# Altium schematic sheet RoBeast_Power_Switching.SchDoc: Power (Switching Regulator)
size A4; ApprovedBy: CR; DrawnBy: VM & IG; Revision: V1; SheetNumber: 3; SheetTotal: 9
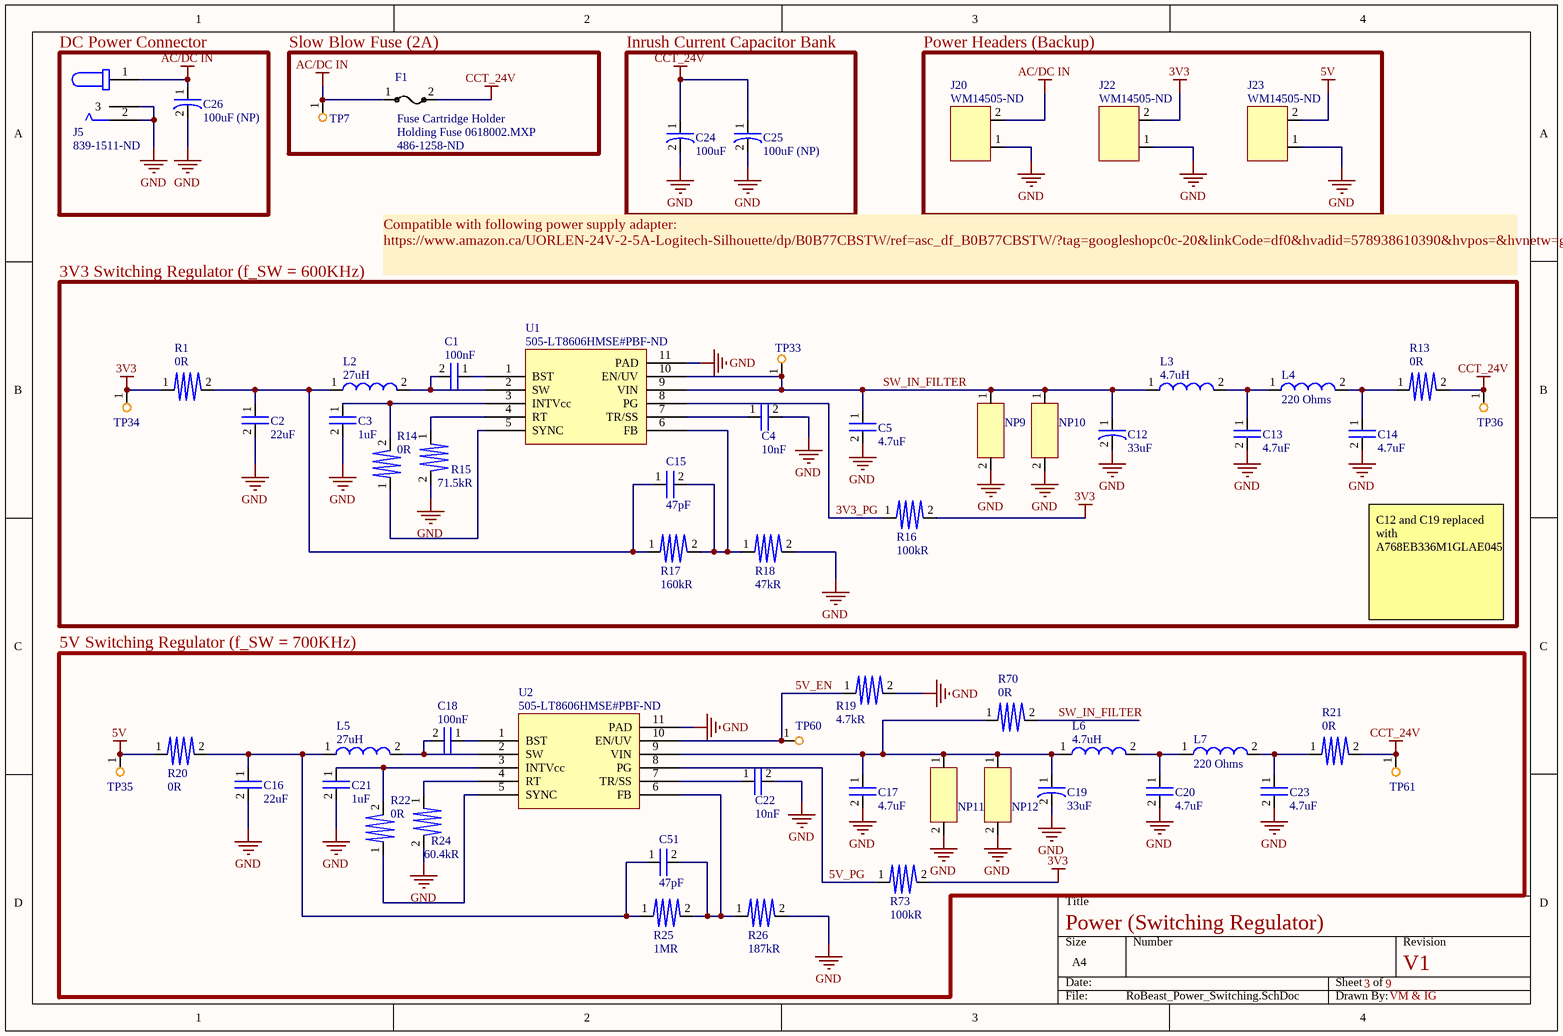
[diagram p0: RoBeast_Power_Switching.SchDoc]

## Parts
C1  100nF  [0805]
C2  22uF  [1206]
C3  1uF  [0805]
C4  10nF  [0805]
C5  4.7uF  [1206]
C12  33uF  [63SXV33M]
C13  4.7uF  [1206]
C14  4.7uF  [1206]
C15  47pF  [0805]
C16  22uF  [1206]
C17  4.7uF  [1206]
C18  100nF  [0805]
C19  33uF  [63SXV33M]
C20  4.7uF  [1206]
C21  1uF  [0805]
C22  10nF  [0805]
C23  4.7uF  [1206]
C24  100uF  [UCD1H101MNL1GS]
C25  100uF (NP)  [UCD1H101MNL1GS]
C26  100uF (NP)  [UCD1H101MNL1GS]
C51  47pF  [0805]
F1  Fuse Cartridge Holder  Supplier Part Number 1: 486-1258-ND  [0031.8201]
J5  Supplier Part Number 1: 839-1511-ND  [54-00128]  (hidden comment: Power Jack Connector)
J20  2 Pin Connector  [WM14505-ND]  (value not drawn)
J22  2 Pin Connector  [WM14505-ND]  (value not drawn)
J23  2 Pin Connector  [WM14505-ND]  (value not drawn)
L2  27uH  [MSS5121-273MLB]
L3  4.7uH  [XAL4030-472MEC]
L4  220 Ohms  [0805]
L5  27uH  [MSS5121-273MLB]
L6  4.7uH  [XAL4030-472MEC]
L7  220 Ohms  [0805]
NP9  Not Populated  [0805]  (value not drawn)
NP10  Not Populated  [0805]  (value not drawn)
NP11  Not Populated  [0805]  (value not drawn)
NP12  Not Populated  [0805]  (value not drawn)
R1  0R  [0805]
R13  0R  [0805]
R14  0R  [0805]
R15  71.5kR  [0805]
R16  100kR  [0805]
R17  160kR  [0805]
R18  47kR  [0805]
R19  4.7kR  [0805]
R20  0R  [0805]
R21  0R  [0805]
R22  0R  [0805]
R24  60.4kR  [0805]
R25  1MR  [0805]
R26  187kR  [0805]
R70  0R  [0805]
R73  100kR  [0805]
TP7  Test Point  [Test Point]  (value not drawn)
TP33  Test Point  [Test Point]  (value not drawn)
TP34  Test Point  [Test Point]  (value not drawn)
TP35  Test Point  [Test Point]  (value not drawn)
TP36  Test Point  [Test Point]  (value not drawn)
TP60  Test Point  [Test Point]  (value not drawn)
TP61  Test Point  [Test Point]  (value not drawn)
U1  Supplier Part Number 1: 505-LT8606HMSE#PBF-ND  [LT8606HMSE#PBF]  (hidden comment: Switching Regulator)
U2  Supplier Part Number 1: 505-LT8606HMSE#PBF-ND  [LT8606HMSE#PBF]  (hidden comment: Switching Regulator)

## Blocks framed on the sheet
DC Power Connector: C26 J5
Slow Blow Fuse (2A): F1 TP7
Inrush Current Capacitor Bank: C24 C25
Power Headers (Backup): J20 J22 J23
3V3 Switching Regulator (f_SW = 600KHz): C1-C5 C12-C15 L2-L4 NP9 NP10 R1 R13-R18 TP33 TP34 TP36 U1
5V Switching Regulator (f_SW = 700KHz): C16-C23 C51 L5-L7 NP11 NP12 R19-R22 R24-R26 R70 R73 TP35 TP60 TP61 U2

## Nets
3V3: J22.2 R1.1 R16.2 R73.2 TP34.1
5V: J23.2 R20.1 TP35.1
AC/DC IN: C26.1 F1.1 J5.1 J20.2 TP7.1
CCT_24V: C24.1 C25.1 F1.2 R13.2 R21.2 TP36.1 TP61.1
GND: C2.2 C3.2 C4.2 C5.2 C12.2 C13.2 C14.2 C16.2 C17.2 C19.2 C20.2 C21.2 C22.2 C23.2 C24.2 C25.2 C26.2 J5.2 J5.3 J20.1 J22.1 J23.1 NP9.2 NP10.2 NP11.2 NP12.2 R15.2 R18.2 R19.2 R24.2 R26.2 U1.11(PAD) U2.11(PAD)
3V3_PG: R16.1 U1.8(PG)
5V_EN: R19.1 TP60.1 U2.10(EN/UV)
5V_PG: R73.1 U2.8(PG)
SW_IN_FILTER: C5.1 C12.1 L3.1 NP9.1 NP10.1 R70.2 TP33.1 U1.9(VIN) U1.10(EN/UV)
NetC1_1: C1.1 U1.1(BST)
NetC1_2: C1.2 L2.2 U1.2(SW)
NetC2_1: C2.1 C15.1 L2.1 R1.2 R17.1
NetC3_1: C3.1 R14.2 U1.3(INTVcc)
NetC4_1: C4.1 U1.7(TR/SS)
NetC13_1: C13.1 L3.2 L4.1
NetC14_1: C14.1 L4.2 R13.1
NetC15_2: C15.2 R17.2 R18.1 U1.6(FB)
NetC16_1: C16.1 C51.1 L5.1 R20.2 R25.1
NetC17_1: C17.1 C19.1 L6.1 NP11.1 NP12.1 R70.1 U2.9(VIN)
NetC18_1: C18.1 U2.1(BST)
NetC18_2: C18.2 L5.2 U2.2(SW)
NetC20_1: C20.1 L6.2 L7.1
NetC21_1: C21.1 R22.2 U2.3(INTVcc)
NetC22_1: C22.1 U2.7(TR/SS)
NetC23_1: C23.1 L7.2 R21.1
NetC51_2: C51.2 R25.2 R26.1 U2.6(FB)
NetR14_1: R14.1 U1.5(SYNC)
NetR15_1: R15.1 U1.4(RT)
NetR22_1: R22.1 U2.5(SYNC)
NetR24_1: R24.1 U2.4(RT)

## Notes on the sheet
- Compatible with following power supply adapter: https://www.amazon.ca/UORLEN-24V-2-5A-Logitech-Silhouette/dp/B0B77CBSTW/ref=asc_df_B0B77CBSTW/?tag=googleshopc0c-20&linkCode=df0&hvadid=578938610390&hvpos=&hvnetw=g&hvrand=15266282696536227734&hvpone=&hvptwo=&hvqmt=&hvdev=c&hvdvcmdl=&hvlocint=&hvlocphy=1002057&hvtargid=pla-1929838423599&psc=1&mcid=fe1e2a77a4a83ddca3018a9fba854ebd
- C12 and C19 replaced with A768EB336M1GLAE045
- (in symbol 0031.8201) Holding Fuse 0618002.MXP

## Library data of the parts
C1 C18 = C0805C104J5RAC7800: Ceramic Capacitor, Multilayer, Ceramic, 50V, 5% +Tol, 5% -Tol, X7R, 15% TC, 0.1uF, Surface Mount, 0805; Manufacturer: KEMET; Manufacturer Part Number: C0805C104J5RACTU; Multilayer: Yes; Supplier 1: Digikey; RoHS: Yes; Category: Ceramic Capacitors; Stock 1: 605061; Pricing 1: 1=0.18, 10=0.122, 50=0.0732, 100=0.0576, 500=0.04252, 1000=0.03519 (USD); Mount: Surface Mount; Number of Pins: 2; Dielectric Material: Ceramic; Package Shape: Rectangular; Size Code: 0805; Terminal Finish: Nickel; Min Operating Temperature: -55°C; Max Operating Temperature: 125°C; JESD-609 Code: e3; Capacitor Type: Ceramic; Negative Tolerance: 5%; Packaging: Tape and Reel; Positive Tolerance: 5%; Rated DC Voltage (URdc): 50V; Temperature Characteristics Code: X7R; Termination: Wraparound; Reach SVHC Compliant: Yes; RoHS Compliant: Yes; ComponentLink1URL: http://capacitoredge.kemet.com:80/capedge2/intellispec.jsp?pn=C0805C104J5RACTU&displayPN=C0805C104J5RACTU&src-supplier=IHS+Markit; ComponentLink1Description: http://capacitoredge.kemet.com:80/capedge2/intellispec.jsp?pn=C0805C104J5RACTU&displayPN=C0805C104J5RACTU&src-supplier=IHS+Markit; ComponentLink2URL: https://datasheet.ciiva.com/7842/1732721-7842179.pdf?src-supplier=Element14; ComponentLink2Description: https://datasheet.ciiva.com/7842/1732721-7842179.pdf?src-supplier=Element14; ComponentLink3URL: https://datasheet.ciiva.com/28682/1851736-28682223.pdf?src-supplier=Element14; ComponentLink3Description: https://datasheet.ciiva.com/28682/1851736-28682223.pdf?src-supplier=Element14; ComponentLink4URL: https://datasheet.ciiva.com/7258/1828800-7258413.pdf?src-supplier=Newark; ComponentLink4Description: https://datasheet.ciiva.com/7258/1828800-7258413.pdf?src-supplier=Newark; ComponentLink5URL: https://datasheet.ciiva.com/14589/70095383-14589015.pdf?src-supplier=Allied+Electronics; ComponentLink5Description: https://datasheet.ciiva.com/14589/70095383-14589015.pdf?src-supplier=Allied+Electronics; ComponentLink6URL: https://datasheet.ciiva.com/5417/kem-c1002-x7r-smd-5417352.pdf?src-supplier=Mouser; ComponentLink6Description: https://datasheet.ciiva.com/5417/kem-c1002-x7r-smd-5417352.pdf?src-supplier=Mouser; ComponentLink7URL: https://datasheet.ciiva.com/39122/docfinderpartnumberc0402c102k5ractu-39122924.pdf?src-supplier=Onlinecomponents.com; ComponentLink7Description: https://datasheet.ciiva.com/39122/docfinderpartnumberc0402c102k5ractu-39122924.pdf?src-supplier=Onlinecomponents.com; Supplier Part Number 1: 399-C0805C104J5RAC7800CT-ND; Capacitance: 100nF
C2 C16 = CL31B226MPHNNNE: Ceramic Capacitor, Multilayer, Ceramic, 10V, 20% +Tol, 20% -Tol, X7R, 15% TC, 22uF, Surface Mount, 1206; Manufacturer: Samsung; Multilayer: Yes; Supplier 1: Digikey; Manufacturer Part Number: CL31B226MPHNNNE; RoHS: Yes; Category: Ceramic Capacitors; Stock 1: 1058662; Pricing 1: 1=0.34, 10=0.225, 50=0.1658, 100=0.1349, 500=0.10654, 1000=0.08996 (USD); Mount: Surface Mount; Number of Pins: 2; Dielectric Material: Ceramic; Package Shape: Rectangular; Size Code: 1206; Terminal Finish: Nickel; Min Operating Temperature: -55°C; Max Operating Temperature: 125°C; JESD-609 Code: e3; Capacitance: 22uF; Capacitor Type: Ceramic; Negative Tolerance: 20%; Packaging: Tape and Reel; Positive Tolerance: 20%; Rated DC Voltage (URdc): 10V; Temperature Characteristics Code: X7R; Termination: Wraparound; Reach SVHC Compliant: Yes; RoHS Compliant: Yes; ComponentLink1URL: https://datasheet.ciiva.com:443/pdfs/VipMasterIC/IC/SEMS/SEMS-S-A0008384515/SEMS-S-A0008872952-1.pdf?src-supplier=IHS+Markit; ComponentLink1Description: https://datasheet.ciiva.com:443/pdfs/VipMasterIC/IC/SEMS/SEMS-S-A0008384515/SEMS-S-A0008872952-1.pdf?src-supplier=IHS+Markit; ComponentLink2URL: https://datasheet.ciiva.com/25792/cl31b226mphnnne-25792003.pdf?src-supplier=Digikey; ComponentLink2Description: https://datasheet.ciiva.com/25792/cl31b226mphnnne-25792003.pdf?src-supplier=Digikey; Supplier Part Number 1: 1276-3148-1-ND
C3 C21 = CC0805JKX7R9BB105: Ceramic Capacitor, Multilayer, Ceramic, 50V, 5% +Tol, 5% -Tol, X7R, 15% TC, 1uF, Surface Mount, 0805; Manufacturer: Yageo; Supplier 1: Digikey; Manufacturer Part Number: CC0805JKX7R9BB105; RoHS: Yes; Category: Ceramic Capacitors; Stock 1: 50247; Pricing 1: 1=0.32, 10=0.207, 50=0.1454, 100=0.1174, 500=0.08724, 1000=0.07633 (USD); ComponentLink1URL: https://datasheet.ciiva.com:443/pdfs/VipMasterIC/IC/YAGO/YAGO-S-A0003557223/YAGO-S-A0003557223-1.pdf?src-supplier=IHS+Markit; ComponentLink1Description: https://datasheet.ciiva.com:443/pdfs/VipMasterIC/IC/YAGO/YAGO-S-A0003557223/YAGO-S-A0003557223-1.pdf?src-supplier=IHS+Markit; ComponentLink2URL: http://www.yageo.com/documents/recent/UPY-GPHC_X7R_6.3V-to-50V_18.pdf?src-supplier=Digikey; ComponentLink2Description: http://www.yageo.com/documents/recent/UPY-GPHC_X7R_6.3V-to-50V_18.pdf?src-supplier=Digikey; Supplier Part Number 1: 311-3498-1-ND
C4 C22 = C0805C103J5RAC7210: Ceramic Capacitor, Multilayer, Ceramic, 50V, 5% +Tol, 5% -Tol, X7R, 15% TC, 0.01uF, Surface Mount, 0805; Manufacturer: KEMET; Multilayer: Yes; Supplier 1: Digikey; Manufacturer Part Number: C0805C103J5RAC7210; RoHS: Yes; Category: Ceramic Capacitors; Stock 1: 247971; Pricing 1: 1=0.1, 10=0.059, 50=0.034, 100=0.0263, 500=0.0198, 1000=0.01555, 2500=0.01414, 5000=0.01301 (USD); Mount: Surface Mount; Number of Pins: 2; Dielectric Material: Ceramic; Package Shape: Rectangular; Size Code: 0805; Terminal Finish: Nickel; Min Operating Temperature: -55°C; Max Operating Temperature: 125°C; JESD-609 Code: e3; Capacitance: 10nF; Capacitor Type: Ceramic; Negative Tolerance: 5%; Packaging: Tape and Reel; Positive Tolerance: 5%; Rated DC Voltage (URdc): 50V; Temperature Characteristics Code: X7R; Termination: Wraparound; Reach SVHC Compliant: Yes; RoHS Compliant: Yes; ComponentLink1URL: https://datasheet.ciiva.com:443/pdfs/VipMasterIC/IC/KEME/KEME-S-A0008991654/KEME-S-A0008991654-1.pdf?src-supplier=IHS+Markit; ComponentLink1Description: https://datasheet.ciiva.com:443/pdfs/VipMasterIC/IC/KEME/KEME-S-A0008991654/KEME-S-A0008991654-1.pdf?src-supplier=IHS+Markit; ComponentLink2URL: http://components.arrow.com/part/dataview/3450688S9650973N7429?src-supplier=Arrow+Electronics; ComponentLink2Description: http://components.arrow.com/part/dataview/3450688S9650973N7429?src-supplier=Arrow+Electronics; ComponentLink3URL: http://www.mouser.com/ds/2/212/KEM_C1002_X7R_SMD-1102033.pdf?src-supplier=Mouser; ComponentLink3Description: http://www.mouser.com/ds/2/212/KEM_C1002_X7R_SMD-1102033.pdf?src-supplier=Mouser; ComponentLink4URL: https://api.kemet.com/component-edge/download/datasheet/C0805C103J5RAC7210.pdf?src-supplier=Digikey; ComponentLink4Description: https://api.kemet.com/component-edge/download/datasheet/C0805C103J5RAC7210.pdf?src-supplier=Digikey; Supplier Part Number 1: 399-17616-1-ND
C5 C13 C14 C17 C20 C23 = C1206C475K5RACAUTO: Ceramic Capacitor, Multilayer, Ceramic, 50V, 10% +Tol, 10% -Tol, X7R, 15% TC, 4.7uF, Surface Mount, 1206; Manufacturer: KEMET; Supplier: Digikey; Supplier Part Number: 399-C1206C475K5RACAUTOCT-ND; Manufacturer Part Number: C1206C475K5RACAUTO; RoHS: Yes; Category: Ceramic Capacitors; Stock: 66; Pricing: 1=0.43, 10=0.285, 50=0.2104, 100=0.1713, 500=0.13522, 1000=0.11418 (USD); ComponentLink1URL: https://datasheet.ciiva.com:443/pdfs/VipMasterIC/IC/KEME/KEME-S-A0009891634/KEME-S-A0009891634-1.pdf?src-supplier=IHS+Markit; ComponentLink1Description: https://datasheet.ciiva.com:443/pdfs/VipMasterIC/IC/KEME/KEME-S-A0009891634/KEME-S-A0009891634-1.pdf?src-supplier=IHS+Markit; ComponentLink2URL: http://www.farnell.com/datasheets/2818560.pdf?src-supplier=Newark; ComponentLink2Description: http://www.farnell.com/datasheets/2818560.pdf?src-supplier=Newark
C12 C19 = 63SXV33M: Aluminum Electrolytic Capacitor, Polarized, Aluminum (solid Polymer), 63V, 20% +Tol, 20% -Tol, 33uF, Surface Mount, 3333; Manufacturer: Panasonic; Supplier 1: Digikey; Manufacturer Part Number: 63SXV33M; RoHS: Yes; Category: Polymer Capacitors; Stock 1: 2602; Pricing 1: 1=3.04, 10=2.334, 50=2.144, 100=1.7777 (USD); ComponentLink1URL: https://datasheet.ciiva.com:443/pdfs/VipMasterIC/IC/PANA/PANA-S-A0009016952/PANA-S-A0009016952-1.pdf?src-supplier=IHS+Markit; ComponentLink1Description: https://datasheet.ciiva.com:443/pdfs/VipMasterIC/IC/PANA/PANA-S-A0009016952/PANA-S-A0009016952-1.pdf?src-supplier=IHS+Markit; ComponentLink2URL: https://media.digikey.com/pdf/Data%20Sheets/Panasonic%20Capacitors%20PDFs/SXE,SXV_Series_63V,80V_Line_Ext.pdf?src-supplier=Digikey; ComponentLink2Description: https://media.digikey.com/pdf/Data%20Sheets/Panasonic%20Capacitors%20PDFs/SXE,SXV_Series_63V,80V_Line_Ext.pdf?src-supplier=Digikey; ComponentLink3URL: http://industrial.panasonic.com/cdbs/www-data/pdf/AAB8000/AAB8000C259.pdf?src-supplier=Newark; ComponentLink3Description: http://industrial.panasonic.com/cdbs/www-data/pdf/AAB8000/AAB8000C259.pdf?src-supplier=Newark; ComponentLink4URL: https://media.digikey.com/pdf/Data%20Sheets/Panasonic%20Capacitors%20PDFs/SXE,SXV_Series_63V,80V_Line_Ext.pdf?src-supplier=Verical; ComponentLink4Description: https://media.digikey.com/pdf/Data%20Sheets/Panasonic%20Capacitors%20PDFs/SXE,SXV_Series_63V,80V_Line_Ext.pdf?src-supplier=Verical; ComponentLink5URL: https://datasheet.octopart.com/63SXV33M-Panasonic-datasheet-78862147.pdf?src-supplier=Element14; ComponentLink5Description: https://datasheet.octopart.com/63SXV33M-Panasonic-datasheet-78862147.pdf?src-supplier=Element14; ComponentLink6URL: https://industrial.panasonic.com/cdbs/www-data/pdf/AAB8000/AAB8000C259.pdf?src-supplier=Digikey; ComponentLink6Description: https://industrial.panasonic.com/cdbs/www-data/pdf/AAB8000/AAB8000C259.pdf?src-supplier=Digikey; ComponentLink7URL: http://industrial.panasonic.com/cdbs/www-data/pdf/AAB8000/AAB8000C259.pdf?src-supplier=Farnell; ComponentLink7Description: http://industrial.panasonic.com/cdbs/www-data/pdf/AAB8000/AAB8000C259.pdf?src-supplier=Farnell; ComponentLink8URL: https://media.digikey.com/pdf/Data%20Sheets/Panasonic%20Capacitors%20PDFs/SXE,SXV_Series_63V,80V_Line_Ext.pdf?src-supplier=Mouser; ComponentLink8Description: https://media.digikey.com/pdf/Data%20Sheets/Panasonic%20Capacitors%20PDFs/SXE,SXV_Series_63V,80V_Line_Ext.pdf?src-supplier=Mouser; ComponentLink9URL: https://media.digikey.com/pdf/Data%20Sheets/Panasonic%20Capacitors%20PDFs/SXE,SXV_Series_63V,80V_Line_Ext.pdf?src-supplier=Onlinecomponents.com; ComponentLink9Description: https://media.digikey.com/pdf/Data%20Sheets/Panasonic%20Capacitors%20PDFs/SXE,SXV_Series_63V,80V_Line_Ext.pdf?src-supplier=Onlinecomponents.com; ComponentLink10URL: https://media.digikey.com/pdf/Data%20Sheets/Panasonic%20Capacitors%20PDFs/SXE,SXV_Series_63V,80V_Line_Ext.pdf?src-supplier=Arrow+Electronics; ComponentLink10Description: https://media.digikey.com/pdf/Data%20Sheets/Panasonic%20Capacitors%20PDFs/SXE,SXV_Series_63V,80V_Line_Ext.pdf?src-supplier=Arrow+Electronics; ComponentLink11URL: https://datasheet.octopart.com/63SXV33M-Panasonic-datasheet-98225043.pdf?src-supplier=Farnell; ComponentLink11Description: https://datasheet.octopart.com/63SXV33M-Panasonic-datasheet-98225043.pdf?src-supplier=Farnell; ComponentLink12URL: https://media.digikey.com/pdf/Data%20Sheets/Panasonic%20Capacitors%20PDFs/SXE,SXV_Series_63V,80V_Line_Ext.pdf?src-supplier=Conrad; ComponentLink12Description: https://media.digikey.com/pdf/Data%20Sheets/Panasonic%20Capacitors%20PDFs/SXE,SXV_Series_63V,80V_Line_Ext.pdf?src-supplier=Conrad; ComponentLink13URL: https://media.digikey.com/pdf/Data%20Sheets/Panasonic%20Capacitors%20PDFs/SXE,SXV_Series_63V,80V_Line_Ext.pdf?src-supplier=TTI; ComponentLink13Description: https://media.digikey.com/pdf/Data%20Sheets/Panasonic%20Capacitors%20PDFs/SXE,SXV_Series_63V,80V_Line_Ext.pdf?src-supplier=TTI; ComponentLink14URL: https://media.digikey.com/pdf/Data%20Sheets/Panasonic%20Capacitors%20PDFs/SXE,SXV_Series_63V,80V_Line_Ext.pdf?src-supplier=Electro+Sonic; ComponentLink14Description: https://media.digikey.com/pdf/Data%20Sheets/Panasonic%20Capacitors%20PDFs/SXE,SXV_Series_63V,80V_Line_Ext.pdf?src-supplier=Electro+Sonic; ComponentLink15URL: https://media.digikey.com/pdf/Data%20Sheets/Panasonic%20Capacitors%20PDFs/SXE,SXV_Series_63V,80V_Line_Ext.pdf?src-supplier=NAC+Semi; ComponentLink15Description: https://media.digikey.com/pdf/Data%20Sheets/Panasonic%20Capacitors%20PDFs/SXE,SXV_Series_63V,80V_Line_Ext.pdf?src-supplier=NAC+Semi; ComponentLink16URL: https://datasheet.octopart.com/63SXV33M-Panasonic-datasheet-136807604.pdf?src-supplier=Master+Electronics; ComponentLink16Description: https://datasheet.octopart.com/63SXV33M-Panasonic-datasheet-136807604.pdf?src-supplier=Master+Electronics; Supplier Part Number 1: P18934CT-ND
C15 C51 = C0805C470J5GAC7210: Ceramic Capacitor, Multilayer, Ceramic, 50V, 5% +Tol, 5% -Tol, C0G, 30ppm/Cel TC, 0.000047uF, Surface Mount, 0805; Manufacturer: KEMET; Supplier 1: Digikey; Manufacturer Part Number: C0805C470J5GAC7210; RoHS: Yes; Category: Ceramic Capacitors; Stock 1: 22724; Pricing 1: 1=0.1, 10=0.054, 50=0.031, 100=0.024, 500=0.01802, 1000=0.01417, 2500=0.01288, 5000=0.01185 (USD); Number of Pins: 2; Dielectric Material: Ceramic; Terminal Finish: Nickel; JESD-609 Code: e3; Capacitor Type: Ceramic; Reach SVHC Compliant: Yes; RoHS Compliant: Yes; ComponentLink1URL: https://datasheet.ciiva.com:443/pdfs/VipMasterIC/IC/KEME/KEME-S-A0005605168/KEME-S-A0005605168-1.pdf?src-supplier=IHS+Markit; ComponentLink1Description: https://datasheet.ciiva.com:443/pdfs/VipMasterIC/IC/KEME/KEME-S-A0005605168/KEME-S-A0005605168-1.pdf?src-supplier=IHS+Markit; ComponentLink2URL: https://datasheet.ciiva.com/11646/kem-c1003-c0g-smd-11646575.pdf?src-supplier=Avnet; ComponentLink2Description: https://datasheet.ciiva.com/11646/kem-c1003-c0g-smd-11646575.pdf?src-supplier=Avnet; Supplier Part Number 1: 399-C0805C470J5GAC7210CT-ND
C24-C26 = UCD1H101MNL1GS: Aluminum Electrolytic Capacitor, Polarized, Aluminum (wet), 50V, 20% +Tol, 20% -Tol, 100uF, Surface Mount, 3333; Manufacturer: Nichicon; Dielectric Material: Aluminium; Leakage Current: 50uA; Ripple Current: 175mA; Tan Delta: 0.1; Supplier 1: Digikey; Manufacturer Part Number: UCD1H101MNL1GS; RoHS: Yes; Category: Aluminum Electrolytic Capacitors; Stock 1: 10305; Pricing 1: 1=0.64, 10=0.45, 50=0.379, 100=0.3086 (USD); Mount: Surface Mount; Number of Pins: 2; Package Shape: Cylindrical; Size Code: 3333; Terminal Finish: Copper; Min Operating Temperature: -55°C; Max Operating Temperature: 105°C; JESD-609 Code: e6; Polarity: Polarized; Capacitance: 100uF; Capacitor Type: Aluminium; Negative Tolerance: 20%; Package Style: SMTMeter; Packaging: Tape and Reel; Positive Tolerance: 20%; Rated DC Voltage (URdc): 50V; Termination: Flat; Length: 8.9mm; Width: 8.3mm; Height: 10mm; Reach SVHC Compliant: No; RoHS Compliant: Yes; ComponentLink1URL: https://datasheet.ciiva.com:443/pdfs/VipMasterIC/IC/NICH/NICH-S-A0003527725/NICH-S-A0003527725-1.pdf?src-supplier=IHS+Markit; ComponentLink1Description: https://datasheet.ciiva.com:443/pdfs/VipMasterIC/IC/NICH/NICH-S-A0003527725/NICH-S-A0003527725-1.pdf?src-supplier=IHS+Markit; ComponentLink2URL: https://datasheet.ciiva.com/11776/0900766b80ebdadd-11776792.pdf?src-supplier=Rs; ComponentLink2Description: https://datasheet.ciiva.com/11776/0900766b80ebdadd-11776792.pdf?src-supplier=Rs; ComponentLink3URL: https://datasheet.ciiva.com/5360/e-cd-22158-5360840.pdf?src-supplier=Mouser; ComponentLink3Description: https://datasheet.ciiva.com/5360/e-cd-22158-5360840.pdf?src-supplier=Mouser; ComponentLink4URL: https://datasheet.ciiva.com/6301/e-cd-6301305.pdf?src-supplier=Digikey; ComponentLink4Description: https://datasheet.ciiva.com/6301/e-cd-6301305.pdf?src-supplier=Digikey; Supplier Part Number 1: 493-6388-1-ND
F1 = 0031.8201: Fuse Holder Open Design; 5 x 20mm; 500V; 10A; 1P; Solder THT 22.5mm; Manufacturer: Schurter; Manufacturer Part Number: 00318201; Supplier 1: Digikey; RoHS: Yes; Category: Fuse Holders; Stock 1: 148074; Pricing 1: 1=0.91, 50=0.676, 100=0.608, 500=0.47 (USD); ComponentLink1URL: https://datasheet.ciiva.com/3014/typ-ogn-3014480.pdf?src-supplier=Avnet; ComponentLink1Description: https://datasheet.ciiva.com/3014/typ-ogn-3014480.pdf?src-supplier=Avnet; ComponentLink2URL: https://datasheet.ciiva.com/3014/typ-ogn-3014480.pdf?src-supplier=Mouser; ComponentLink2Description: https://datasheet.ciiva.com/3014/typ-ogn-3014480.pdf?src-supplier=Mouser; ComponentLink3URL: https://datasheet.ciiva.com/16215/typ-ogn-16215099.pdf?src-supplier=Onlinecomponents.com; ComponentLink3Description: https://datasheet.ciiva.com/16215/typ-ogn-16215099.pdf?src-supplier=Onlinecomponents.com; ComponentLink4URL: https://datasheet.ciiva.com/16203/typ-ogn-16203626.pdf?src-supplier=Future+Electronics; ComponentLink4Description: https://datasheet.ciiva.com/16203/typ-ogn-16203626.pdf?src-supplier=Future+Electronics; ComponentLink5URL: https://datasheet.ciiva.com/15188/getdatasheetpartid-392104-15188042.pdf?src-supplier=Verical; ComponentLink5Description: https://datasheet.ciiva.com/15188/getdatasheetpartid-392104-15188042.pdf?src-supplier=Verical; ComponentLink6URL: https://datasheet.ciiva.com/1269/1842496-1269251.pdf?src-supplier=Element14; ComponentLink6Description: https://datasheet.ciiva.com/1269/1842496-1269251.pdf?src-supplier=Element14; ComponentLink7URL: https://datasheet.ciiva.com/25893/typ-ogn-25893934.pdf?; ComponentLink7Description: https://datasheet.ciiva.com/25893/typ-ogn-25893934.pdf?
J5 = 54-00128: Conn DC Power RCP 2 POS Solder RA Thru-Hole 3 Terminal 1 Port; Manufacturer: Tensility; Supplier 1: Digikey; Manufacturer Part Number: 54-00128; RoHS: No; Category: Connectors; Stock 1: 19136; Pricing 1: 1=0.91, 10=0.767, 100=0.6888, 1000=0.50096, 5000=0.43834, 10000=0.41642 (USD); ComponentLink1URL: http://www.tensility.com/pdffiles/54-00128.pdf?src-supplier=Digikey; ComponentLink1Description: http://www.tensility.com/pdffiles/54-00128.pdf?src-supplier=Digikey
J20 J22 J23 = WM14505-ND: Board Connector, 2 Contact(s), 2 Row(s), Male, Right Angle, Solder Terminal; Manufacturer: Molex; Manufacturer Part Number: 0026013114; Mixed Contacts: No; Number of Contacts: 2; Option: General Purpose; Mating Information: MULTIPLE MATING PARTS AVAILABLE; Supplier: Mouser; RoHS: Yes; Stock: 22788; Pricing: 1=1.12, 10=0.793, 50=0.793, 100=0.704, 1000=0.635, 10000=0.528 (USD); Mounting Technology: Board; Contact Material: Brass; Contact Finish - Mating: GOLD; Contact Finish - Termination: Matte Tin (Sn); Connector Type: BOARD CONNECTOR; JESD-609 Code: e3; Contact Gender: Male; Mounting Style: RIGHT ANGLE; Termination: Solder; Filter Feature: No; Number of Rows Loaded: 2; Flammability Rating: UL94 V-2; Reach SVHC Compliant: Yes; RoHS Compliant: Yes; DIN Conformance: No; IEC Conformance: No; MIL Conformance: No; ComponentLink1URL: https://datasheet.ciiva.com:443/pdfs/VipMasterIC/IC/MOLE/MOLE-S-A0006764423/MOLE-S-A0006865681-1.pdf?src-supplier=IHS+Markit; ComponentLink1Description: https://datasheet.ciiva.com:443/pdfs/VipMasterIC/IC/MOLE/MOLE-S-A0006764423/MOLE-S-A0006865681-1.pdf?src-supplier=IHS+Markit; Supplier 1: Digikey; Supplier Part Number: 538-26-01-3114; Supplier Part Number 1: WM14505-ND
L2 L5 = MSS5121-273MLB: General Purpose Inductor, 27uH, 20%, 1 Element, Ferrite-Core, SMD, 2020; Manufacturer: Coilcraft; Case/Size Code: 2020; DC Resistance (DCR): 420mR; Inductor Application: POWER INDUCTOR; Number of Functions: 1; Rated Current-Max: 850mA; Self Resonant Frequency: 27MHz; Shape/Size Description: RECTANGULAR PACKAGE; Shielding: Shielded; Test Frequency: 100kHz; Package Height: 2.2mm; Package Length: 6mm; Supplier 1: Mouser; Manufacturer Part Number: MSS5121-273MLB; RoHS: Yes; Category: Fixed Inductors; Stock 1: 439; Pricing 1: 1=1.8, 10=1.8, 50=1.8, 100=1.8, 1000=0.878, 10000=0.817 (USD); Number of Pins: 2; Core Material: Ferrite; Terminal Finish: Nickel; Min Operating Temperature: -40°C; Max Operating Temperature: 125°C; Tolerance: 20%; JESD-609 Code: e3; Construction: Shielded; Inductance-Nom (L): 27uH; Inductor Type: GENERAL PURPOSE INDUCTOR; Package Style: SMTMeter; Packaging: Tape and Reel; Surface Mount: Yes; Terminal Placement: Dual Ended; Termination: Wraparound; Package Width: 6mm; Reach SVHC Compliant: Yes; RoHS Compliant: Yes; ComponentLink1URL: https://datasheet.ciiva.com:443/pdfs/VipMasterIC/IC/COLC/COLC-S-A0003131943/COLC-S-A0003131943-1.pdf?src-supplier=IHS+Markit; ComponentLink1Description: https://datasheet.ciiva.com:443/pdfs/VipMasterIC/IC/COLC/COLC-S-A0003131943/COLC-S-A0003131943-1.pdf?src-supplier=IHS+Markit; ComponentLink2URL: https://datasheet.ciiva.com/22680/1681961-22680287.pdf?src-supplier=Element14; ComponentLink2Description: https://datasheet.ciiva.com/22680/1681961-22680287.pdf?src-supplier=Element14; Supplier Part Number 1: 994-MSS5121-273MLB
L3 L6 = XAL4030-472MEC: General Purpose Inductor, 4.7uH, 20%, 1 Element, Composite-Core, SMD, 1616; Manufacturer: Coilcraft; Case/Size Code: 1515; DC Resistance (DCR): 44.1mR; Inductor Application: POWER INDUCTOR; Number of Functions: 1; Rated Current-Max: 5.1A; Self Resonant Frequency: 36MHz; Shape/Size Description: RECTANGULAR PACKAGE; Shielding: Shielded; Test Frequency: 100kHz; Package Height: 3.1mm; Package Length: 4mm; Reference Standard: AEC-Q200; Supplier 1: DigiKey; Manufacturer Part Number: XAL4030-472MEC; RoHS: Yes; Category: Fixed Inductors; Stock 1: 103962; Pricing 1: 1=2.43, 10=2.43, 50=2.43, 100=2.43, 1000=1.11, 10000=1.11 (USD); Number of Pins: 2; Core Material: Composite; Terminal Finish: Tin; Min Operating Temperature: -40°C; Max Operating Temperature: 125°C; Tolerance: 20%; JESD-609 Code: e2; Construction: Chip; Inductance-Nom (L): 4.7uH; Inductor Type: GENERAL PURPOSE INDUCTOR; Package Style: SMTMeter; Packaging: Tape and Reel; Surface Mount: Yes; Terminal Placement: Dual Ended; Termination: One Surface; Package Width: 4mm; Reach SVHC Compliant: Yes; RoHS Compliant: Yes; ComponentLink1URL: https://datasheet.ciiva.com:443/pdfs/VipMasterIC/IC/COLC/COLC-S-A0006757288/COLC-S-A0006757288-1.pdf?src-supplier=IHS+Markit; ComponentLink1Description: https://datasheet.ciiva.com:443/pdfs/VipMasterIC/IC/COLC/COLC-S-A0006757288/COLC-S-A0006757288-1.pdf?src-supplier=IHS+Markit; ComponentLink2URL: https://datasheet.ciiva.com/22701/1681987-22701559.pdf?src-supplier=Element14; ComponentLink2Description: https://datasheet.ciiva.com/22701/1681987-22701559.pdf?src-supplier=Element14; ComponentLink3URL: https://datasheet.ciiva.com/13277/xal4000-270751-13277257.pdf?src-supplier=Mouser; ComponentLink3Description: https://datasheet.ciiva.com/13277/xal4000-270751-13277257.pdf?src-supplier=Mouser; Supplier Part Number 1: 2457-XAL4030-472MEC-ND
L4 L7 = MPZ2012S221AT000: Ferrite Chip, 1 Function(s), 3A; Manufacturer: TDK; DC Resistance-Max: 40mR; Max Frequency: 100MHz; Number of Functions: 1; Output Impedance: 220R; Supplier 1: Digikey; Manufacturer Part Number: MPZ2012S221AT000; RoHS: Yes; Category: Ferrite Beads and Chips; Stock 1: 260953; Pricing 1: 1=0.12, 10=0.094, 25=0.0848, 50=0.0622, 100=0.0537, 250=0.0424, 500=0.03582, 1000=0.03016 (USD); Mount: Surface Mount; Material: Ferrite; Case Code: 0805; Terminal Finish: Copper; Min Operating Temperature: -55°C; Max Operating Temperature: 125°C; Construction: Chip Bead; Filter Type: FERRITE CHIP; Min Frequency: 100MHz; Packaging: Tape and Reel; Current Rating: 3A; JESD-609 Code: e2; Length: 2mm; Width: 1.25mm; Height: 0.85mm; Reach SVHC Compliant: Yes; RoHS Compliant: Yes; ComponentLink1URL: https://datasheet.ciiva.com:443/pdfs/VipMasterIC/IC/TDKC/TDKC-S-A0008032886/TDKC-S-A0008032886-1.pdf?src-supplier=IHS+Markit; ComponentLink1Description: https://datasheet.ciiva.com:443/pdfs/VipMasterIC/IC/TDKC/TDKC-S-A0008032886/TDKC-S-A0008032886-1.pdf?src-supplier=IHS+Markit; ComponentLink2URL: https://datasheet.ciiva.com/46381/1750041-46381647.pdf?src-supplier=Element14; ComponentLink2Description: https://datasheet.ciiva.com/46381/1750041-46381647.pdf?src-supplier=Element14; ComponentLink3URL: https://datasheet.ciiva.com/46634/beads-commercial-power-mpz-en-46634582.pdf?src-supplier=Digikey; ComponentLink3Description: https://datasheet.ciiva.com/46634/beads-commercial-power-mpz-en-46634582.pdf?src-supplier=Digikey; ComponentLink4URL: https://datasheet.ciiva.com/46634/beads-commercial-power-mpz-en-46634586.pdf?src-supplier=Digikey; ComponentLink4Description: https://datasheet.ciiva.com/46634/beads-commercial-power-mpz-en-46634586.pdf?src-supplier=Digikey; Supplier Part Number 1: 445-MPZ2012S221AT000CT-ND
NP9-NP12 = NP
R1 R13 R14 R20-R22 R70 = RMCF0805ZT0R00: Fixed Resistor, Metal Glaze/thick Film, 0.125W, 0ohm, Surface Mount, 0805; Manufacturer: Stackpole Electronics; Rated Power Dissipation (P): 125mW; Rated Temperature: 70°C; Working Voltage: 150V; Package Height: 0.5mm; Package Length: 2mm; Package Width: 1.25mm; Reference Standard: AEC-Q200; Supplier 1: Digikey; Manufacturer Part Number: RMCF0805ZT0R00; RoHS: Yes; Category: Chip SMD Resistors; Stock 1: 1154169; Pricing 1: 1=0.1, 10=0.017, 25=0.0128, 50=0.0096, 100=0.0068, 250=0.00544, 500=0.00436, 1000=0.00321 (USD); Mount: Surface Mount; Number of Pins: 2; Package Shape: Rectangular; Size Code: 0805; Terminal Finish: Nickel; Min Operating Temperature: -55°C; Max Operating Temperature: 155°C; JESD-609 Code: e3; Resistor Type: FIXED RESISTOR; Construction: Rectangular; Package Style: SMTMeter; Packaging: Tape and Reel; Resistance: 0R; Technology: METAL GLAZE/THICK FILM; Termination: Wraparound; Reach SVHC Compliant: Yes; RoHS Compliant: Yes; ComponentLink1URL: https://datasheet.ciiva.com:443/pdfs/VipMasterIC/IC/SEIE/SEIE-S-A0007077258/SEIE-S-A0007077258-1.pdf?src-supplier=IHS+Markit; ComponentLink1Description: https://datasheet.ciiva.com:443/pdfs/VipMasterIC/IC/SEIE/SEIE-S-A0007077258/SEIE-S-A0007077258-1.pdf?src-supplier=IHS+Markit; ComponentLink2URL: https://datasheet.ciiva.com/15193/getdatasheetpartid-360417-15193658.pdf?src-supplier=Verical; ComponentLink2Description: https://datasheet.ciiva.com/15193/getdatasheetpartid-360417-15193658.pdf?src-supplier=Verical; Supplier Part Number 1: RMCF0805ZT0R00CT-ND
R15 = RK73H2ATTD7152F: Fixed Resistor, Metal Glaze/thick Film, 0.25W, 71500ohm, 150V, 1% +/-Tol, 100ppm/Cel, Surface Mount, 0805; Manufacturer: KOA Speer; Additional Feature: PRECISION; Rated Power Dissipation (P): 250mW; Rated Temperature: 70°C; Temperature Coefficient: 100ppm/°C; Package Height: 0.5mm; Package Length: 2mm; Package Width: 1.25mm; Reference Standard: AEC-Q200; Supplier 1: Digikey; Manufacturer Part Number: RK73H2ATTD7152F; RoHS: Yes; Category: Chip SMD Resistors; Stock 1: 821; Pricing 1: 1=0.1, 10=0.027, 50=0.0172, 100=0.0144, 500=0.00992, 1000=0.00858 (USD); Mount: Surface Mount; Number of Pins: 2; Size Code: 0805; Terminal Finish: Nickel; Min Operating Temperature: -55°C; Max Operating Temperature: 155°C; Tolerance: 1%; JESD-609 Code: e3; Resistor Type: FIXED RESISTOR; Construction: Rectangular; Package Style: SMTMeter; Packaging: Tape and Reel; Resistance: 71.5kR; Technology: METAL GLAZE/THICK FILM; Termination: Wraparound; Working Voltage: 150V; Reach SVHC Compliant: Yes; RoHS Compliant: Yes; ComponentLink1URL: https://datasheet.ciiva.com:443/pdfs/VipMasterIC/IC/KOAS/KOAS-S-A0009586304/KOAS-S-A0009586304-1.pdf?src-supplier=IHS+Markit; ComponentLink1Description: https://datasheet.ciiva.com:443/pdfs/VipMasterIC/IC/KOAS/KOAS-S-A0009586304/KOAS-S-A0009586304-1.pdf?src-supplier=IHS+Markit; ComponentLink2URL: https://datasheet.ciiva.com/7765/549017-7765254.pdf?src-supplier=Element14; ComponentLink2Description: https://datasheet.ciiva.com/7765/549017-7765254.pdf?src-supplier=Element14; ComponentLink3URL: https://datasheet.ciiva.com/5557/rk73h-5557790.pdf?src-supplier=Mouser; ComponentLink3Description: https://datasheet.ciiva.com/5557/rk73h-5557790.pdf?src-supplier=Mouser; Supplier Part Number 1: 2019-RK73H2ATTD7152FCT-ND
R16 R73 = CRCW0805100KFKEAHP: Fixed Resistor, Metal Glaze/thick Film, 0.5W, 100000ohm, 150V, 1% +/-Tol, 100ppm/Cel, Surface Mount, 0805; Manufacturer: Vishay; Manufacturer Series: CRCW-HPE3; Rated Power Dissipation (P): 500mW; Rated Temperature: 70°C; Temperature Coefficient: 100ppm/°C; Package Height: 0.5mm; Package Length: 2mm; Package Width: 1.25mm; Reference Standard: AEC-Q200; Supplier 1: Digikey; Manufacturer Part Number: CRCW0805100KFKEAHP; RoHS: Yes; Category: Chip SMD Resistors; Stock 1: 104274; Pricing 1: 1=0.2, 10=0.103, 50=0.0688, 100=0.0587, 500=0.0421, 1000=0.03706 (USD); Mount: Surface Mount; Number of Pins: 2; Package Shape: Rectangular; Terminal Finish: Nickel; Size Code: 0805; Min Operating Temperature: -55°C; Max Operating Temperature: 155°C; Tolerance: 1%; JESD-609 Code: e3; Package Style: SMTMeter; Technology: METAL GLAZE/THICK FILM; Resistor Type: FIXED RESISTOR; Construction: Chip; Packaging: Tape and Reel; Resistance: 100kR; Series: CRCW-HP E3; Termination: Wraparound; Working Voltage: 150V; Reach SVHC Compliant: Yes; RoHS Compliant: Yes; ComponentLink1URL: https://datasheet.ciiva.com:443/pdfs/VipMasterIC/IC/VISH/VISH-S-A0009391795/VISH-S-A0009391795-1.pdf?src-supplier=IHS+Markit; ComponentLink1Description: https://datasheet.ciiva.com:443/pdfs/VipMasterIC/IC/VISH/VISH-S-A0009391795/VISH-S-A0009391795-1.pdf?src-supplier=IHS+Markit; ComponentLink2URL: https://datasheet.ciiva.com/2475/crcwhpe3-2475664.pdf?src-supplier=Digikey; ComponentLink2Description: https://datasheet.ciiva.com/2475/crcwhpe3-2475664.pdf?src-supplier=Digikey; ComponentLink3URL: https://datasheet.ciiva.com/8982/crcwhpe3-8982333.pdf?src-supplier=Avnet; ComponentLink3Description: https://datasheet.ciiva.com/8982/crcwhpe3-8982333.pdf?src-supplier=Avnet; ComponentLink4URL: https://datasheet.ciiva.com/7777/424479-7777350.pdf?src-supplier=Element14; ComponentLink4Description: https://datasheet.ciiva.com/7777/424479-7777350.pdf?src-supplier=Element14; ComponentLink5URL: https://datasheet.ciiva.com/7777/424479-7777351.pdf?src-supplier=Element14; ComponentLink5Description: https://datasheet.ciiva.com/7777/424479-7777351.pdf?src-supplier=Element14; Supplier Part Number 1: 541-100KTCT-ND
R17 = RC0805FR-07160KL: Fixed Resistor, Metal Glaze/thick Film, 0.125W, 160000ohm, 150V, 1% +/-Tol, 100ppm/Cel, Surface Mount, 0805; Manufacturer: Yageo; Additional Feature: LASER TRIMMABLE; Power: 125mW; Rated Temperature: 70°C; Temperature Coefficient: 100ppm/°C; Package Height: 0.5mm; Package Length: 2mm; Package Width: 1.25mm; Supplier: Digikey; Supplier Part Number: 311-160KCRCT-ND; Manufacturer Part Number: RC0805FR-07160KL; RoHS: Yes; Category: Chip SMD Resistors; Stock: 270491; Pricing: 1=0.1, 10=0.025, 50=0.016, 100=0.0133, 500=0.00912, 1000=0.00787 (USD); Mounting Technology: Surface Mount; Pins: 2; Package Shape: Rectangular; Case/Package: 0805; Terminal Finish: Nickel; Min Operating Temperature: -55°C; Max Operating Temperature: 155°C; Tolerance: 1%; JESD-609 Code: e3; Resistor Type: FIXED RESISTOR; Construction: Chip; Package Style: SMTMeter; Packaging: Tape and Reel; Value: 160kR; Technology: METAL GLAZE/THICK FILM; Termination: Wraparound; Working Voltage: 150V; Reach SVHC Compliant: Yes; RoHS Compliant: Yes; ComponentLink1URL: https://datasheet.ciiva.com:443/pdfs/VipMasterIC/IC/YAGO/YAGO-S-A0008145938/YAGO-S-A0008145938-1.pdf?src-supplier=IHS+Markit; ComponentLink1Description: https://datasheet.ciiva.com:443/pdfs/VipMasterIC/IC/YAGO/YAGO-S-A0008145938/YAGO-S-A0008145938-1.pdf?src-supplier=IHS+Markit; ComponentLink2URL: https://datasheet.ciiva.com/11808/0900766b8106beab-11808868.pdf?src-supplier=Rs; ComponentLink2Description: https://datasheet.ciiva.com/11808/0900766b8106beab-11808868.pdf?src-supplier=Rs; ComponentLink3URL: https://datasheet.ciiva.com/2457/pyu-r-int-thick-7-2457007.pdf?src-supplier=Digikey; ComponentLink3Description: https://datasheet.ciiva.com/2457/pyu-r-int-thick-7-2457007.pdf?src-supplier=Digikey; ComponentLink4URL: https://datasheet.ciiva.com/2457/pyu-r-int-thick-7-2457005.pdf?src-supplier=Digikey; ComponentLink4Description: https://datasheet.ciiva.com/2457/pyu-r-int-thick-7-2457005.pdf?src-supplier=Digikey; ComponentLink5URL: https://datasheet.ciiva.com/17061/rc0805-17061772.pdf?src-supplier=Future+Electronics; ComponentLink5Description: https://datasheet.ciiva.com/17061/rc0805-17061772.pdf?src-supplier=Future+Electronics
R18 = WR08X4702FTL: Fixed Resistor, Metal Glaze/thick Film, 0.125W, 47000ohm, 150V, 1% +/-Tol, 100ppm/Cel, Surface Mount, 0805; Manufacturer: Walsin Technologies; Power: 125mW; Rated Temperature: 70°C; Temperature Coefficient: 100ppm/°C; Package Height: 0.5mm; Package Length: 2mm; Package Width: 1.25mm; Supplier: Digikey; Supplier Part Number: 1292-WR08X4702FTLCT-ND; Manufacturer Part Number: WR08X4702FTL; RoHS: Yes; Category: Chip SMD Resistors; Stock: 4079; Pricing: 1=0.1, 10=0.02, 50=0.0124, 100=0.0103, 500=0.007, 1000=0.00601 (USD); Mounting Technology: Surface Mount; Pins: 2; Package Shape: Rectangular; Case/Package: 0805; Terminal Finish: Nickel; Min Operating Temperature: -55°C; Max Operating Temperature: 155°C; Tolerance: 1%; JESD-609 Code: e3; Resistor Type: FIXED RESISTOR; Packaging: Tape and Reel; Value: 47kR; Termination: Wraparound; Working Voltage: 150V; Construction: Chip; Package Style: SMTMeter; Technology: METAL GLAZE/THICK FILM; Reach SVHC Compliant: Yes; RoHS Compliant: Yes; ComponentLink1URL: https://datasheet.ciiva.com:443/pdfs/VipMasterIC/IC/WATC/WATC-S-A0005256878/WATC-S-A0005256878-1.pdf?src-supplier=IHS+Markit; ComponentLink1Description: https://datasheet.ciiva.com:443/pdfs/VipMasterIC/IC/WATC/WATC-S-A0005256878/WATC-S-A0005256878-1.pdf?src-supplier=IHS+Markit; ComponentLink2URL: http://www.farnell.com/datasheets/1960319.pdf?src-supplier=Farnell; ComponentLink2Description: http://www.farnell.com/datasheets/1960319.pdf?src-supplier=Farnell; ComponentLink3URL: https://www.verical.com/server-webapp/html/getDatasheet?partID=415239&src-supplier=Verical; ComponentLink3Description: https://www.verical.com/server-webapp/html/getDatasheet?partID=415239&src-supplier=Verical; ComponentLink4URL: http://www.farnell.com/datasheets/1960319.pdf?src-supplier=Element14; ComponentLink4Description: http://www.farnell.com/datasheets/1960319.pdf?src-supplier=Element14; ComponentLink5URL: http://www.farnell.com/datasheets/1960319.pdf?src-supplier=Newark; ComponentLink5Description: http://www.farnell.com/datasheets/1960319.pdf?src-supplier=Newark
R19 = RCC08054K70FKEA: Fixed Resistor, Metal Glaze/thick Film, 0.25W, 4700ohm, 200V, 1% +/-Tol, 100ppm/Cel, Surface Mount, 0805; Manufacturer: Vishay Dale; Supplier 1: Digikey; Manufacturer Part Number: RCC08054K70FKEA; RoHS: Yes; Category: Chip SMD Resistors; Stock 1: 96612; Pricing 1: 1=0.15, 10=0.069, 50=0.0454, 100=0.0385, 500=0.0271, 1000=0.0236 (USD); Supplier Part Number 1: 541-RCC08054K70FKEACT-ND
R24 = CRCW080560K4FKEA: Fixed Resistor, Metal Glaze/thick Film, 0.125W, 60400ohm, 150V, 1% +/-Tol, 100ppm/Cel, Surface Mount, 0805; Manufacturer: Vishay; Rated Power Dissipation (P): 125mW; Rated Temperature: 70°C; Temperature Coefficient: 100ppm/°C; Package Height: 0.45mm; Package Length: 2mm; Package Width: 1.25mm; Reference Standard: AEC-Q200; Supplier 1: Digikey; Manufacturer Part Number: CRCW080560K4FKEA; RoHS: Yes; Category: Chip SMD Resistors; Stock 1: 41115; Pricing 1: 1=0.1, 10=0.038, 50=0.0248, 100=0.021, 500=0.01462, 1000=0.01273 (USD); Mount: Surface Mount; Number of Pins: 2; Package Shape: Rectangular; Size Code: 0805; Terminal Finish: Nickel; Min Operating Temperature: -55°C; Max Operating Temperature: 155°C; Tolerance: 1%; JESD-609 Code: e3; Resistor Type: FIXED RESISTOR; Construction: Chip; Package Style: SMTMeter; Packaging: Tape and Reel; Resistance: 60.4kR; Technology: METAL GLAZE/THICK FILM; Termination: Wraparound; Working Voltage: 150V; Reach SVHC Compliant: Yes; RoHS Compliant: Yes; ComponentLink1URL: https://datasheet.ciiva.com:443/pdfs/VipMasterIC/IC/VISH/VISH-S-A0007266705/VISH-S-A0007266705-1.pdf?src-supplier=IHS+Markit; ComponentLink1Description: https://datasheet.ciiva.com:443/pdfs/VipMasterIC/IC/VISH/VISH-S-A0007266705/VISH-S-A0007266705-1.pdf?src-supplier=IHS+Markit; ComponentLink2URL: https://datasheet.ciiva.com/11812/0900766b80d98b26-11812606.pdf?src-supplier=Rs; ComponentLink2Description: https://datasheet.ciiva.com/11812/0900766b80d98b26-11812606.pdf?src-supplier=Rs; ComponentLink3URL: https://datasheet.ciiva.com/2496/dcrcwe3-2496163.pdf?src-supplier=Digikey; ComponentLink3Description: https://datasheet.ciiva.com/2496/dcrcwe3-2496163.pdf?src-supplier=Digikey; ComponentLink4URL: https://datasheet.ciiva.com/2496/dcrcwe3-2496164.pdf?src-supplier=Digikey; ComponentLink4Description: https://datasheet.ciiva.com/2496/dcrcwe3-2496164.pdf?src-supplier=Digikey; ComponentLink5URL: https://datasheet.ciiva.com/2496/dcrcwe3-2496165.pdf?src-supplier=Digikey; ComponentLink5Description: https://datasheet.ciiva.com/2496/dcrcwe3-2496165.pdf?src-supplier=Digikey; ComponentLink6URL: https://datasheet.ciiva.com/8996/dcrcwe3-8996426.pdf?src-supplier=Avnet; ComponentLink6Description: https://datasheet.ciiva.com/8996/dcrcwe3-8996426.pdf?src-supplier=Avnet; ComponentLink7URL: https://datasheet.ciiva.com/8996/dcrcwe3-8996428.pdf?src-supplier=Avnet; ComponentLink7Description: https://datasheet.ciiva.com/8996/dcrcwe3-8996428.pdf?src-supplier=Avnet; ComponentLink8URL: https://datasheet.ciiva.com/16761/70201119-16761640.pdf?src-supplier=Allied+Electronics; ComponentLink8Description: https://datasheet.ciiva.com/16761/70201119-16761640.pdf?src-supplier=Allied+Electronics; ComponentLink9URL: https://datasheet.ciiva.com/16763/70201119-16763337.pdf?src-supplier=Allied+Electronics; ComponentLink9Description: https://datasheet.ciiva.com/16763/70201119-16763337.pdf?src-supplier=Allied+Electronics; ComponentLink10URL: https://datasheet.ciiva.com/22702/1697337-22702842.pdf?src-supplier=Element14; ComponentLink10Description: https://datasheet.ciiva.com/22702/1697337-22702842.pdf?src-supplier=Element14; ComponentLink11URL: https://datasheet.ciiva.com/7816/1697337-7816106.pdf?src-supplier=Element14; ComponentLink11Description: https://datasheet.ciiva.com/7816/1697337-7816106.pdf?src-supplier=Element14; ComponentLink12URL: https://datasheet.ciiva.com/7816/1697337-7816107.pdf?src-supplier=Element14; ComponentLink12Description: https://datasheet.ciiva.com/7816/1697337-7816107.pdf?src-supplier=Element14; Supplier Part Number 1: 541-60.4KCCT-ND
R25 = RC0805FR-131ML: Fixed Resistor, Metal Glaze/thick Film, 0.125W, 1000000ohm, 150V, 1% +/-Tol, 100ppm/Cel, Surface Mount, 0805; Manufacturer: Yageo; Additional Feature: LASER TRIMMABLE; Rated Power Dissipation (P): 125mW; Rated Temperature: 70°C; Temperature Coefficient: 100ppm/°C; Package Height: 0.5mm; Package Length: 2mm; Package Width: 1.25mm; Supplier 1: Digikey; Manufacturer Part Number: RC0805FR-131ML; RoHS: Yes; Category: Chip SMD Resistors; Stock 1: 43680; Pricing 1: 1=0.1, 10=0.025, 50=0.016, 100=0.0133, 500=0.00912, 1000=0.00787, 5000=0.00577, 10000=0.00511 (USD); Mount: Surface Mount; Number of Pins: 2; Package Shape: Rectangular; Size Code: 0805; Terminal Finish: Nickel; Min Operating Temperature: -55°C; Max Operating Temperature: 155°C; Tolerance: 1%; JESD-609 Code: e3; Resistor Type: FIXED RESISTOR; Construction: Chip; Package Style: SMTMeter; Packaging: Tape and Reel; Resistance: 1MR; Technology: METAL GLAZE/THICK FILM; Termination: Wraparound; Working Voltage: 150V; Reach SVHC Compliant: Yes; RoHS Compliant: Yes; ComponentLink1URL: https://datasheet.ciiva.com:443/pdfs/VipMasterIC/IC/YAGO/YAGO-S-A0008145938/YAGO-S-A0008145938-1.pdf?src-supplier=IHS+Markit; ComponentLink1Description: https://datasheet.ciiva.com:443/pdfs/VipMasterIC/IC/YAGO/YAGO-S-A0008145938/YAGO-S-A0008145938-1.pdf?src-supplier=IHS+Markit; ComponentLink2URL: https://datasheet.ciiva.com/17332/rc0805-17332618.pdf?src-supplier=Future+Electronics; ComponentLink2Description: https://datasheet.ciiva.com/17332/rc0805-17332618.pdf?src-supplier=Future+Electronics; ComponentLink3URL: https://datasheet.ciiva.com/12560/rc0805-257173-12560472.pdf?src-supplier=Mouser; ComponentLink3Description: https://datasheet.ciiva.com/12560/rc0805-257173-12560472.pdf?src-supplier=Mouser; Supplier Part Number 1: 13-RC0805FR-131MLCT-ND
R26 = RT0805BRD07187KL: Fixed Resistor, Thin Film, 0.125W, 187000ohm, 150V, 0.1% +/-Tol, 25ppm/Cel, Surface Mount, 0805; Manufacturer: Yageo; Additional Feature: HIGH PRECISION; Rated Power Dissipation (P): 125mW; Rated Temperature: 70°C; Temperature Coefficient: 25ppm/°C; Package Height: 0.5mm; Package Length: 2mm; Package Width: 1.25mm; Supplier 1: Digikey; Manufacturer Part Number: RT0805BRD07187KL; RoHS: Yes; Category: Chip SMD Resistors; Stock 1: 5495; Pricing 1: 1=0.15, 10=0.113, 50=0.0884, 100=0.0791, 500=0.06002, 1000=0.05296 (USD); Mount: Surface Mount; Number of Pins: 2; Size Code: 0805; Min Operating Temperature: -55°C; Max Operating Temperature: 155°C; Tolerance: 0.1%; Resistor Type: FIXED RESISTOR; Construction: Chip; Package Style: SMTMeter; Packaging: Tape and Reel; Resistance: 187kR; Technology: THIN FILM; Termination: Wraparound; Working Voltage: 150V; Reach SVHC Compliant: Yes; RoHS Compliant: Yes; ComponentLink1URL: https://datasheet.ciiva.com:443/pdfs/VipMasterIC/IC/YAGO/YAGO-S-A0008510989/YAGO-S-A0008510989-1.pdf?src-supplier=IHS+Markit; ComponentLink1Description: https://datasheet.ciiva.com:443/pdfs/VipMasterIC/IC/YAGO/YAGO-S-A0008510989/YAGO-S-A0008510989-1.pdf?src-supplier=IHS+Markit; ComponentLink2URL: https://datasheet.ciiva.com/2584/pyu-rt-1-to-0-05-rohs-l-5-2584781.pdf?src-supplier=Digikey; ComponentLink2Description: https://datasheet.ciiva.com/2584/pyu-rt-1-to-0-05-rohs-l-5-2584781.pdf?src-supplier=Digikey; Supplier Part Number 1: 13-RT0805BRD07187KLCT-ND
U1 U2 = LT8606HMSE#PBF: Manufacturer: Analog Devices; Time @ Peak Reflow Temperature-Max (s): 30s; Supplier 1: Digikey; Manufacturer Part Number: LT8606HMSE#PBF; RoHS: Yes; Category: Voltage Regulators - Switching; Stock 1: 1797; Pricing 1: 1=5.03, 10=4.519, 50=4.2724, 100=3.7027, 250=3.5128, 500=3.152, 1000=2.65832, 2500=2.5254 (USD); Terminal Finish: Tin; JESD-609 Code: e3; Analog IC - Other Type: SWITCHING REGULATOR; Moisture Sensitivity Level: 1; Peak Reflow Temperature (Cel): 260°C; Reach SVHC Compliant: Yes; RoHS Compliant: Yes; ComponentLink1URL: https://datasheet.ciiva.com:443/pdfs/VipMasterIC/IC/LITC/LITC-S-A0003568646/LITC-S-A0003568646-1.pdf?src-supplier=IHS+Markit; ComponentLink1Description: https://datasheet.ciiva.com:443/pdfs/VipMasterIC/IC/LITC/LITC-S-A0003568646/LITC-S-A0003568646-1.pdf?src-supplier=IHS+Markit